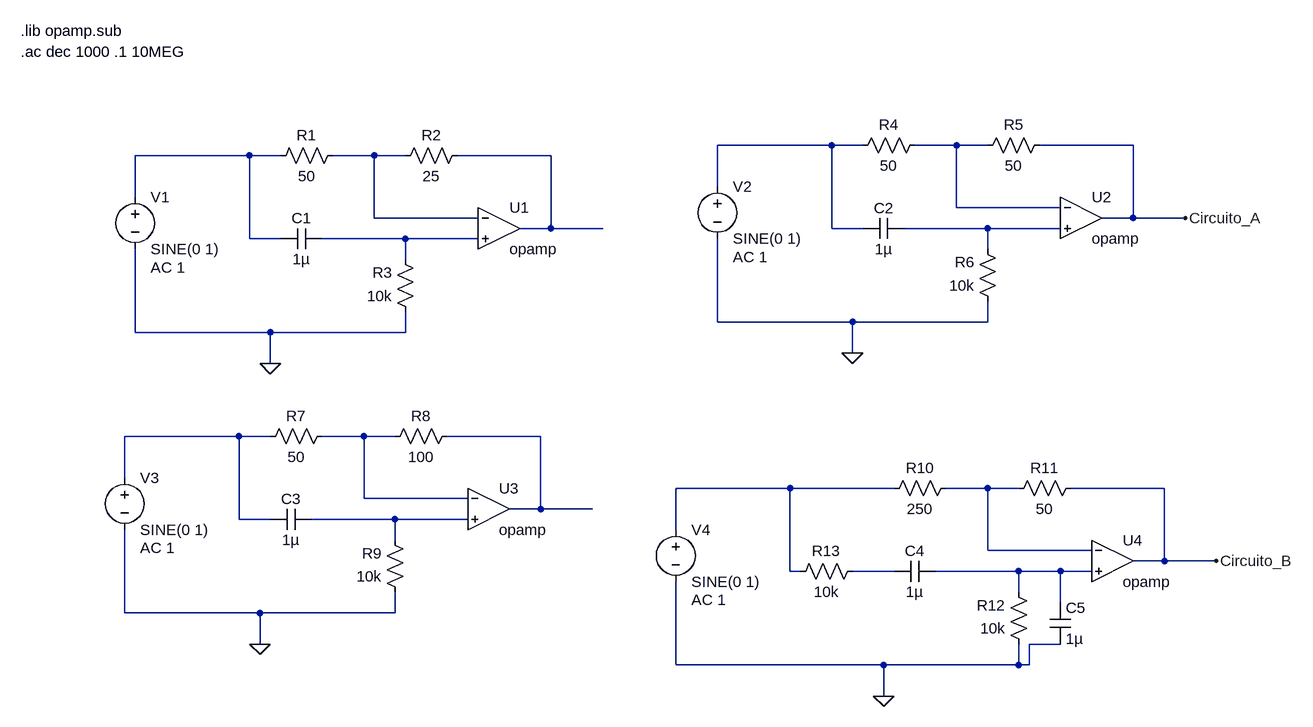
[diagram p0: schematic Analisis frecuencia del circuito.asc]
Analisis frecuencia del circuito.asc, the LTspice schematic file:
Version 4
SHEET 1 1624 964
WIRE 896 96 720 96
WIRE 944 96 896 96
WIRE 1088 96 1024 96
WIRE 1136 96 1088 96
WIRE 1360 96 1216 96
WIRE 0 112 -176 112
WIRE 48 112 0 112
WIRE 192 112 128 112
WIRE 240 112 192 112
WIRE 464 112 320 112
WIRE 720 160 720 96
WIRE -176 176 -176 112
WIRE 1088 192 1088 96
WIRE 1248 192 1088 192
WIRE 192 208 192 112
WIRE 352 208 192 208
WIRE 1360 208 1360 96
WIRE 1360 208 1312 208
WIRE 1440 208 1360 208
WIRE 464 224 464 112
WIRE 464 224 416 224
WIRE 544 224 464 224
WIRE 896 224 896 96
WIRE 944 224 896 224
WIRE 1136 224 1008 224
WIRE 1248 224 1136 224
WIRE 0 240 0 112
WIRE 48 240 0 240
WIRE 240 240 112 240
WIRE 352 240 240 240
WIRE 1136 256 1136 224
WIRE 240 272 240 240
WIRE 720 368 720 240
WIRE 928 368 720 368
WIRE 1136 368 1136 336
WIRE 1136 368 928 368
WIRE -176 384 -176 256
WIRE 32 384 -176 384
WIRE 240 384 240 352
WIRE 240 384 32 384
WIRE 928 416 928 368
WIRE 32 432 32 384
WIRE -16 544 -192 544
WIRE 32 544 -16 544
WIRE 176 544 112 544
WIRE 224 544 176 544
WIRE 448 544 304 544
WIRE -192 608 -192 544
WIRE 832 624 656 624
WIRE 992 624 832 624
WIRE 1136 624 1072 624
WIRE 1184 624 1136 624
WIRE 1408 624 1264 624
WIRE 176 640 176 544
WIRE 336 640 176 640
WIRE 448 656 448 544
WIRE 448 656 400 656
WIRE 528 656 448 656
WIRE -16 672 -16 544
WIRE 32 672 -16 672
WIRE 224 672 96 672
WIRE 336 672 224 672
WIRE 656 688 656 624
WIRE 224 704 224 672
WIRE 1136 720 1136 624
WIRE 1296 720 1136 720
WIRE 1408 736 1408 624
WIRE 1408 736 1360 736
WIRE 1488 736 1408 736
WIRE 832 752 832 624
WIRE 848 752 832 752
WIRE 992 752 928 752
WIRE 1184 752 1056 752
WIRE 1248 752 1184 752
WIRE 1296 752 1248 752
WIRE 1184 784 1184 752
WIRE 1248 800 1248 752
WIRE -192 816 -192 688
WIRE 16 816 -192 816
WIRE 224 816 224 784
WIRE 224 816 16 816
WIRE 16 864 16 816
WIRE 1248 864 1200 864
WIRE 656 896 656 768
WIRE 976 896 656 896
WIRE 1184 896 1184 864
WIRE 1184 896 976 896
WIRE 1200 896 1200 864
WIRE 1200 896 1184 896
WIRE 976 944 976 896
FLAG 32 432 0
FLAG 928 416 0
FLAG 16 864 0
FLAG 976 944 0
FLAG 1440 208 Circuito_A
FLAG 1488 736 Circuito_B
SYMBOL res 144 96 R90
WINDOW 0 0 56 VBottom 2
WINDOW 3 32 56 VTop 2
SYMATTR InstName R1
SYMATTR Value 50
SYMBOL res 336 96 R90
WINDOW 0 0 56 VBottom 2
WINDOW 3 32 56 VTop 2
SYMATTR InstName R2
SYMATTR Value 25
SYMBOL res 256 368 R180
WINDOW 0 36 76 Left 2
WINDOW 3 36 40 Left 2
SYMATTR InstName R3
SYMATTR Value 10k
SYMBOL cap 112 224 R90
WINDOW 0 0 32 VBottom 2
WINDOW 3 32 32 VTop 2
SYMATTR InstName C1
SYMATTR Value 1µ
SYMBOL voltage -176 160 R0
WINDOW 123 24 124 Left 2
WINDOW 39 0 0 Left 0
SYMATTR Value2 AC 1
SYMATTR InstName V1
SYMATTR Value SINE(0 1)
SYMBOL OpAmps\\opamp 384 160 R0
SYMATTR InstName U1
SYMBOL res 1040 80 R90
WINDOW 0 0 56 VBottom 2
WINDOW 3 32 56 VTop 2
SYMATTR InstName R4
SYMATTR Value 50
SYMBOL res 1232 80 R90
WINDOW 0 0 56 VBottom 2
WINDOW 3 32 56 VTop 2
SYMATTR InstName R5
SYMATTR Value 50
SYMBOL res 1152 352 R180
WINDOW 0 36 76 Left 2
WINDOW 3 36 40 Left 2
SYMATTR InstName R6
SYMATTR Value 10k
SYMBOL cap 1008 208 R90
WINDOW 0 0 32 VBottom 2
WINDOW 3 32 32 VTop 2
SYMATTR InstName C2
SYMATTR Value 1µ
SYMBOL voltage 720 144 R0
WINDOW 123 24 124 Left 2
WINDOW 39 0 0 Left 0
SYMATTR Value2 AC 1
SYMATTR InstName V2
SYMATTR Value SINE(0 1)
SYMBOL OpAmps\\opamp 1280 144 R0
SYMATTR InstName U2
SYMBOL res 128 528 R90
WINDOW 0 0 56 VBottom 2
WINDOW 3 32 56 VTop 2
SYMATTR InstName R7
SYMATTR Value 50
SYMBOL res 320 528 R90
WINDOW 0 0 56 VBottom 2
WINDOW 3 32 56 VTop 2
SYMATTR InstName R8
SYMATTR Value 100
SYMBOL res 240 800 R180
WINDOW 0 36 76 Left 2
WINDOW 3 36 40 Left 2
SYMATTR InstName R9
SYMATTR Value 10k
SYMBOL cap 96 656 R90
WINDOW 0 0 32 VBottom 2
WINDOW 3 32 32 VTop 2
SYMATTR InstName C3
SYMATTR Value 1µ
SYMBOL voltage -192 592 R0
WINDOW 123 24 124 Left 2
WINDOW 39 0 0 Left 0
SYMATTR Value2 AC 1
SYMATTR InstName V3
SYMATTR Value SINE(0 1)
SYMBOL OpAmps\\opamp 368 592 R0
SYMATTR InstName U3
SYMBOL res 1088 608 R90
WINDOW 0 0 56 VBottom 2
WINDOW 3 32 56 VTop 2
SYMATTR InstName R10
SYMATTR Value 250
SYMBOL res 1280 608 R90
WINDOW 0 0 56 VBottom 2
WINDOW 3 32 56 VTop 2
SYMATTR InstName R11
SYMATTR Value 50
SYMBOL res 1200 880 R180
WINDOW 0 36 76 Left 2
WINDOW 3 36 40 Left 2
SYMATTR InstName R12
SYMATTR Value 10k
SYMBOL cap 1056 736 R90
WINDOW 0 0 32 VBottom 2
WINDOW 3 32 32 VTop 2
SYMATTR InstName C4
SYMATTR Value 1µ
SYMBOL voltage 656 672 R0
WINDOW 123 24 124 Left 2
WINDOW 39 0 0 Left 0
SYMATTR Value2 AC 1
SYMATTR InstName V4
SYMATTR Value SINE(0 1)
SYMBOL OpAmps\\opamp 1328 672 R0
SYMATTR InstName U4
SYMBOL cap 1232 800 R0
SYMATTR InstName C5
SYMATTR Value 1µ
SYMBOL res 944 736 R90
WINDOW 0 0 56 VBottom 2
WINDOW 3 32 56 VTop 2
SYMATTR InstName R13
SYMATTR Value 10k
TEXT -352 -48 Left 2 !.ac dec 1000 .1 10MEG
TEXT -352 -80 Left 2 !.lib opamp.sub

The netlist it stands for:
* Analisis frecuencia del circuito.asc
R1 N004 N003 50
R2 N005 N004 25
R3 0 N007 10k
C1 N007 N003 1µ
V1 N003 0 SINE(0 1) AC 1
XU1 N004 N007 N005 opamp Aol=100K GBW=10Meg  ; pins invin noninvin out
R4 N002 N001 50
R5 Circuito_A N002 50
R6 0 N006 10k
C2 N006 N001 1µ
V2 N001 0 SINE(0 1) AC 1
XU2 N002 N006 Circuito_A opamp Aol=100K GBW=10Meg  ; pins invin noninvin out
R7 N009 N008 50
R8 N010 N009 100
R9 0 N013 10k
C3 N013 N008 1µ
V3 N008 0 SINE(0 1) AC 1
XU3 N009 N013 N010 opamp Aol=100K GBW=10Meg  ; pins invin noninvin out
R10 N012 N011 250
R11 Circuito_B N012 50
R12 0 N015 10k
C4 N015 N014 1µ
V4 N011 0 SINE(0 1) AC 1
XU4 N012 N015 Circuito_B opamp Aol=100K GBW=10Meg  ; pins invin noninvin out
C5 N015 0 1µ
R13 N014 N011 10k
.ac dec 1000 .1 10MEG
.lib opamp.sub
.backanno
.end